# EAGLE design b-switch (EAGLE 6.5.0)
AUTHOR: Pat Pannuto; REV: A; TITLE: B-Switch
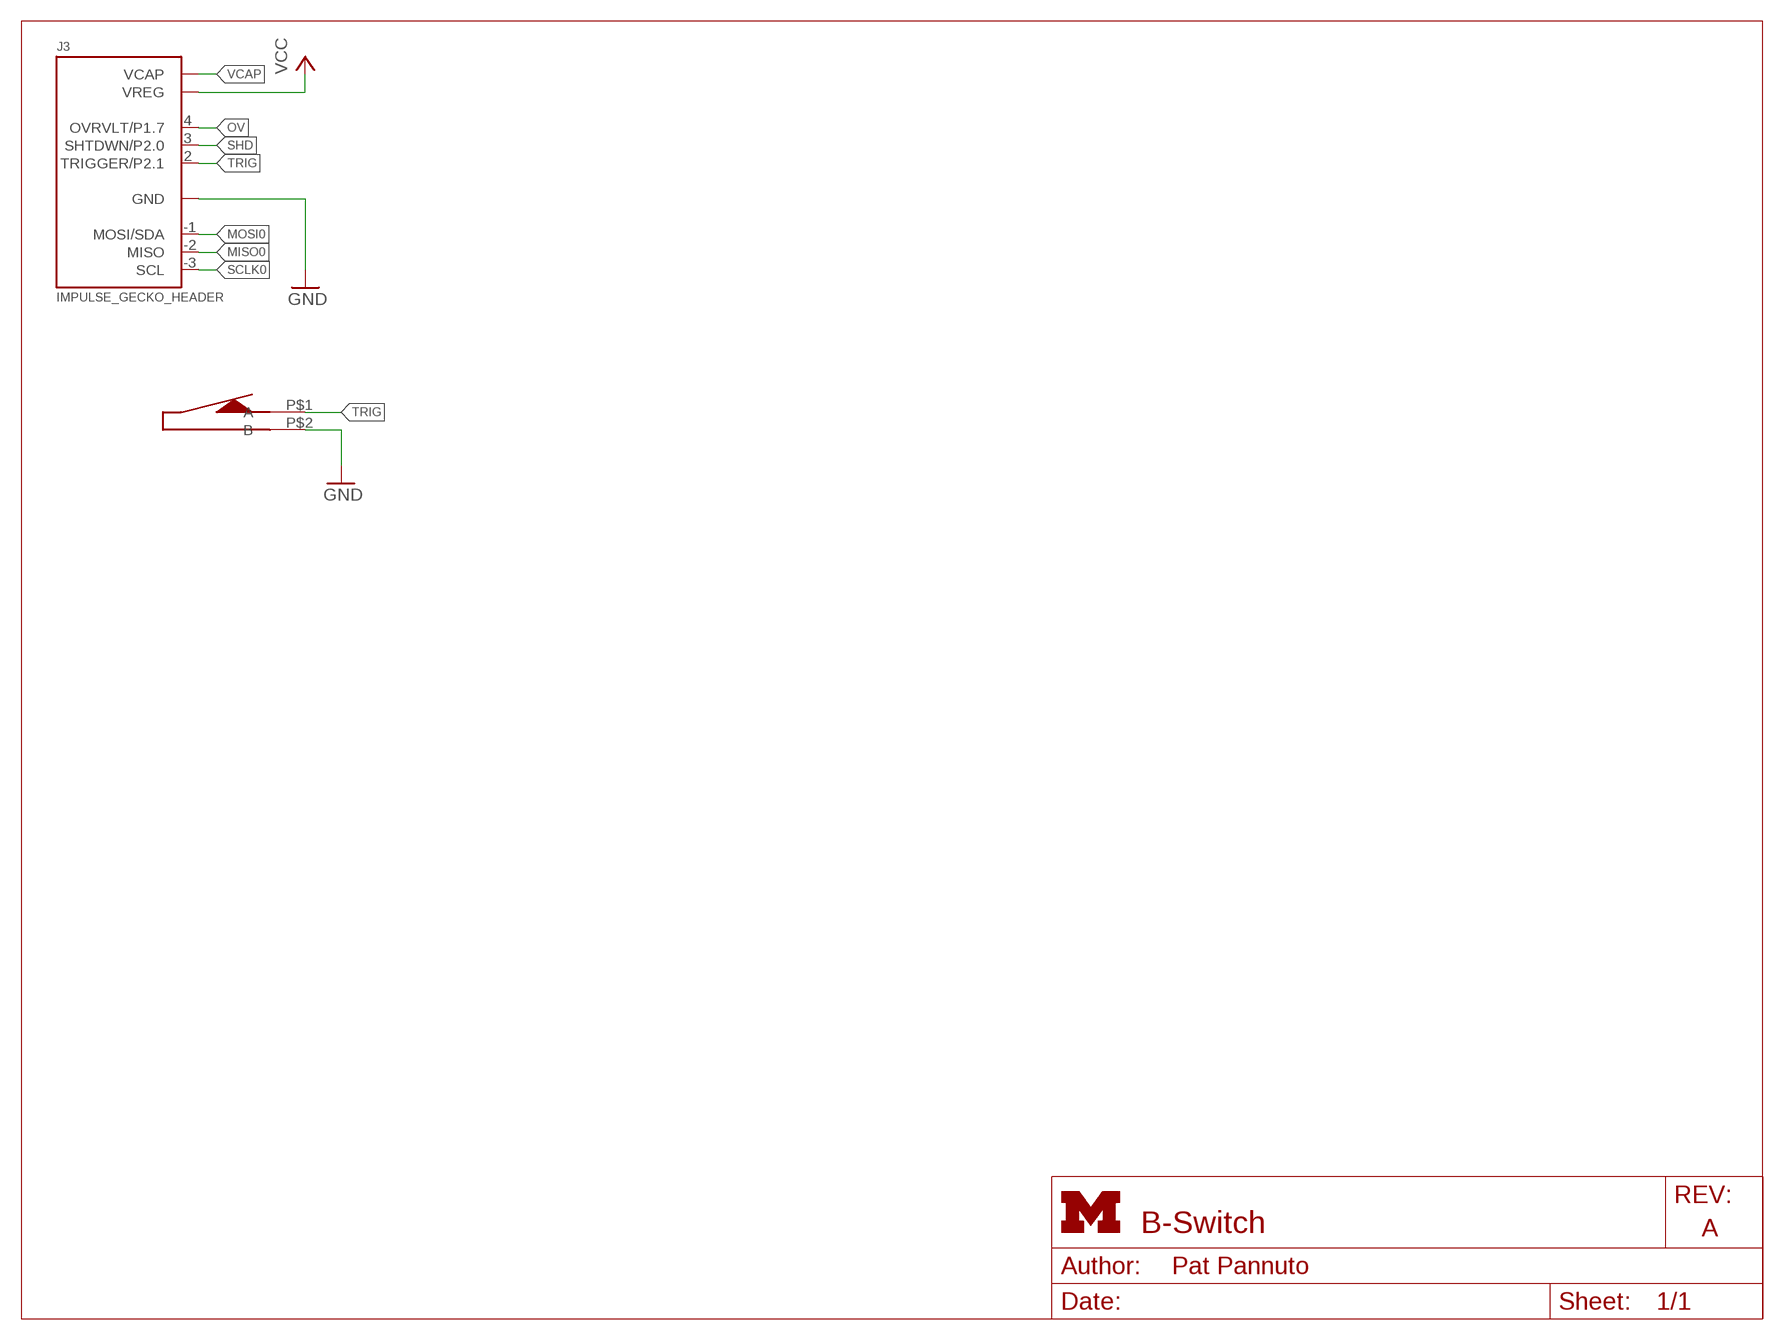
[diagram p0: schematic, sheet 1]
FRAME1 (LETTER_L): HEIGHT: 8.5in; WIDTH: 11in

## Parts
J3  IMPULSE_GECKO_HEADER  [HEADER1X9/0.05IN]
U$1  HAMLIN-59140  [HAMLIN-59140]

## Nets
GND: J3.0(GND) U$1.P$2(B)
MISO0: J3.-2(MISO)
MOSI0: J3.-1(MOSI/SDA)
OV: J3.4(OVRVLT/P1.7)
SCLK0: J3.-3(SCL)
SHD: J3.3(SHTDWN/P2.0)
TRIG: J3.2(TRIGGER/P2.1) U$1.P$1(A)
VCAP: J3.5(VCAP)
VCC: J3.1(VREG)

## Library data of the parts
J3 = gecko:IMPULSE_GECKO_HEADER: Header on the impulse EPIC-esque board.
U$1 = activator:HAMLIN-59140: Normally-closed Reed Switch; DIGIKEY: HE626-ND

## Board
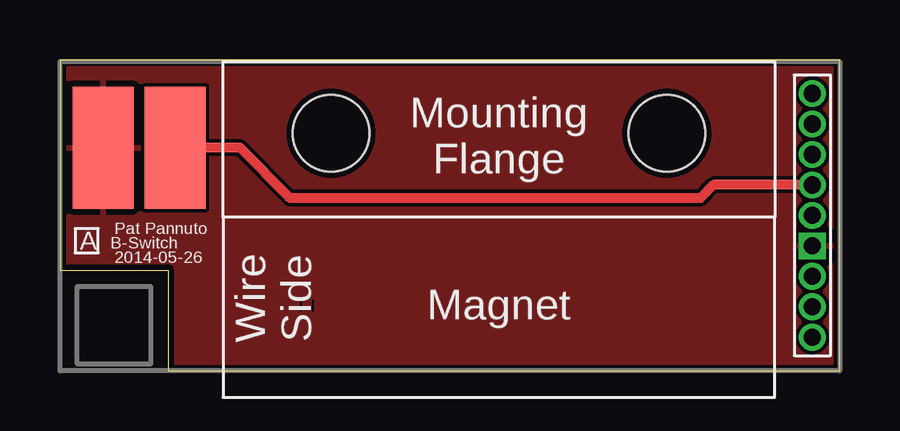
[diagram p1: board, top side]
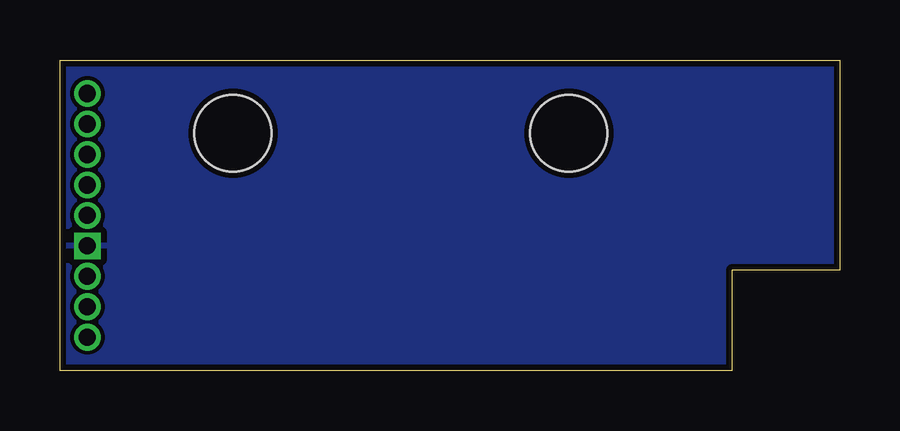
[diagram p2: board, bottom side, seen from below]

Size 32.51 x 12.95 mm. Coordinates in mm from the lower left corner, seen from the top.
Outline: 4.5,0 32.51,0 32.51,12.95 0,12.95 0,4.2 4.5,4.2 4.5,0
Copper layers (1*16): Top 0.0178mm / dielectric 12mil / Bottom 0.0178mm
Design rules "sunstone-4lyr_v1.0.0.3 *": minimum track width 6mil, minimum drill 8mil, track to track 6mil, track to pad 6mil, pad to pad 6mil, via to via 6mil, smd to smd 6mil, copper to edge 10mil, drill to drill 16mil, minimum pad ring 8mil, minimum via ring 8mil, stop-mask expansion 3mil, vias tented up to drill 8mil, thermal gap 10mil
tRestrict: area 10,2.5 to 10.1,3; area 10.5,2.5 to 10.6,3; area 25.8,9 to 26.2,9.1

### Footprints (pad centres in the part's own frame; a part is rotated, then mirrored left to right if it is on the bottom)
HEADER1X9/0.05IN = drill 0.711 pad 1.016 square: 0 -1.27,0 | drill 0.711 pad 1.016: 1 0,0; 2 1.27,0; 3 2.54,0; 4 3.81,0; 5 5.08,0; -1 -2.54,0; -2 -3.81,0; -3 -5.08,0
HAMLIN-59140 = smd 2.54 x 5.08: P$1 13.5,-2.9; P$2 16.5,-2.9 | hole 3.2: -7,-3.5; 7,-3.5

### Placement (x,y rotation side)
J3  31.37,6.48 90 top
U$1  18.3,6.4 180 top

### Tracks (layer width: path | path; a pad name or v marks a point on that pad's centre or on a via)
GND
  pour Top: 33.02,13.72 33.02,-0.51 4.5,-0.51 4.5,4.23 -0.56,4.21 -0.56,13.72
  pour Bottom: -0.56,13.72 33.02,13.72 33.02,-0.51 -0.56,-0.51
TRIG
  Top 0.406: J3.2 27.25,7.75 26.7,7.2 9.6,7.2 7.5,9.3 U$1.P$1

### Text on the board
tPlace: Pat Pannuto | A | B-Switch | 2014-05-26
tDocu: VCAP | OV | SHTD | TRIG | VREG | GND | MOSI | ANT | MISO | SCL